# Altium schematic sheet BPDC high.SchDoc
size A
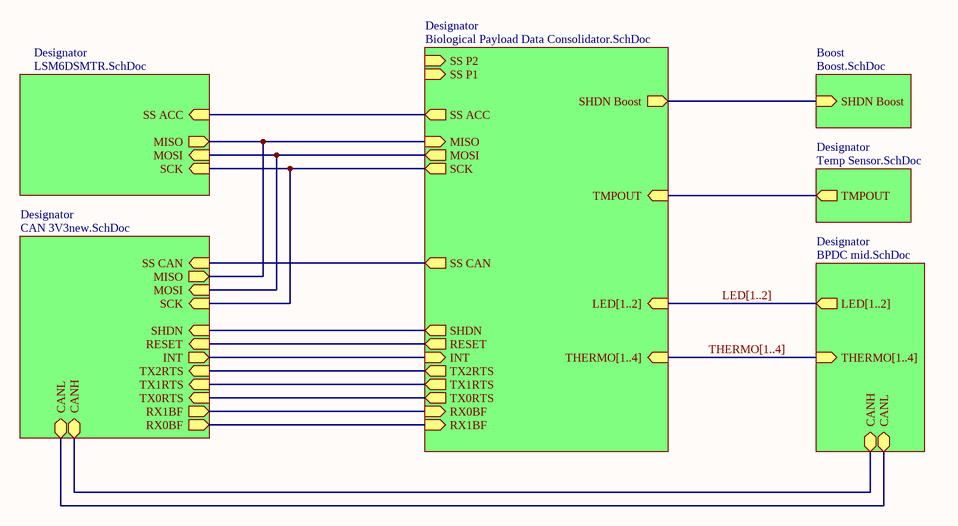
[diagram p0: BPDC high.SchDoc]

## Sub-sheets
Boost = Boost.SchDoc: SHDN Boost (in)
Designator = CAN 3V3new.SchDoc: RX0BF (out), SS CAN (in), SCK (in), TX0RTS (in), CANH (bidir), TX1RTS (in), CANL (bidir), RESET (in), INT (out), TX2RTS (in), RX1BF (out), MOSI (in), MISO (out), SHDN (in)
Designator = LSM6DSMTR.SchDoc: MOSI (in), MISO (out), SCK (in), SS ACC (in)
Designator = Biological Payload Data Consolidator.SchDoc: TX0RTS (out), INT (in), THERMO[1..4] (in), MOSI (out), TX2RTS (out), SS CAN (out), RX0BF (in), SS ACC (out), SCK (out), RX1BF (in), TMPOUT (in), LED[1..2] (in), TX1RTS (out), RESET (out), MISO (in), SS P1 (in), SS P2 (in), SHDN (out), SHDN Boost (out)
Designator = Temp Sensor.SchDoc: TMPOUT (out)
Designator = BPDC mid.SchDoc: THERMO[1..4] (in), CANL (bidir), CANH (bidir), LED[1..2] (out)

## Nets
(unnamed): sheet Designator/RX0BF, sheet Designator/RX1BF
(unnamed): sheet Designator/SS CAN, sheet Designator/SS CAN
(unnamed): sheet Designator/SCK, sheet Designator/SCK, sheet Designator/SCK
(unnamed): sheet Designator/TX0RTS, sheet Designator/TX0RTS
(unnamed): sheet Designator/CANH, sheet Designator/CANH
(unnamed): sheet Designator/TX1RTS, sheet Designator/TX1RTS
(unnamed): sheet Designator/CANL, sheet Designator/CANL
(unnamed): sheet Designator/RESET, sheet Designator/RESET
(unnamed): sheet Designator/INT, sheet Designator/INT
(unnamed): sheet Designator/TX2RTS, sheet Designator/TX2RTS
(unnamed): sheet Designator/RX1BF, sheet Designator/RX0BF
(unnamed): sheet Designator/MOSI, sheet Designator/MOSI, sheet Designator/MOSI
(unnamed): sheet Designator/MISO, sheet Designator/MISO, sheet Designator/MISO
(unnamed): sheet Designator/SHDN, sheet Designator/SHDN
(unnamed): sheet Designator/SS ACC, sheet Designator/SS ACC
(unnamed): sheet Designator/TMPOUT, sheet Designator/TMPOUT
(unnamed): sheet Designator/SHDN Boost, sheet Boost/SHDN Boost

## Buses and harness runs
bus LED[1..2] = sheet Designator/LED[1..2]
bus THERMO[1..4] = sheet Designator/THERMO[1..4]